# Altium project Alimentation.PrjPcb
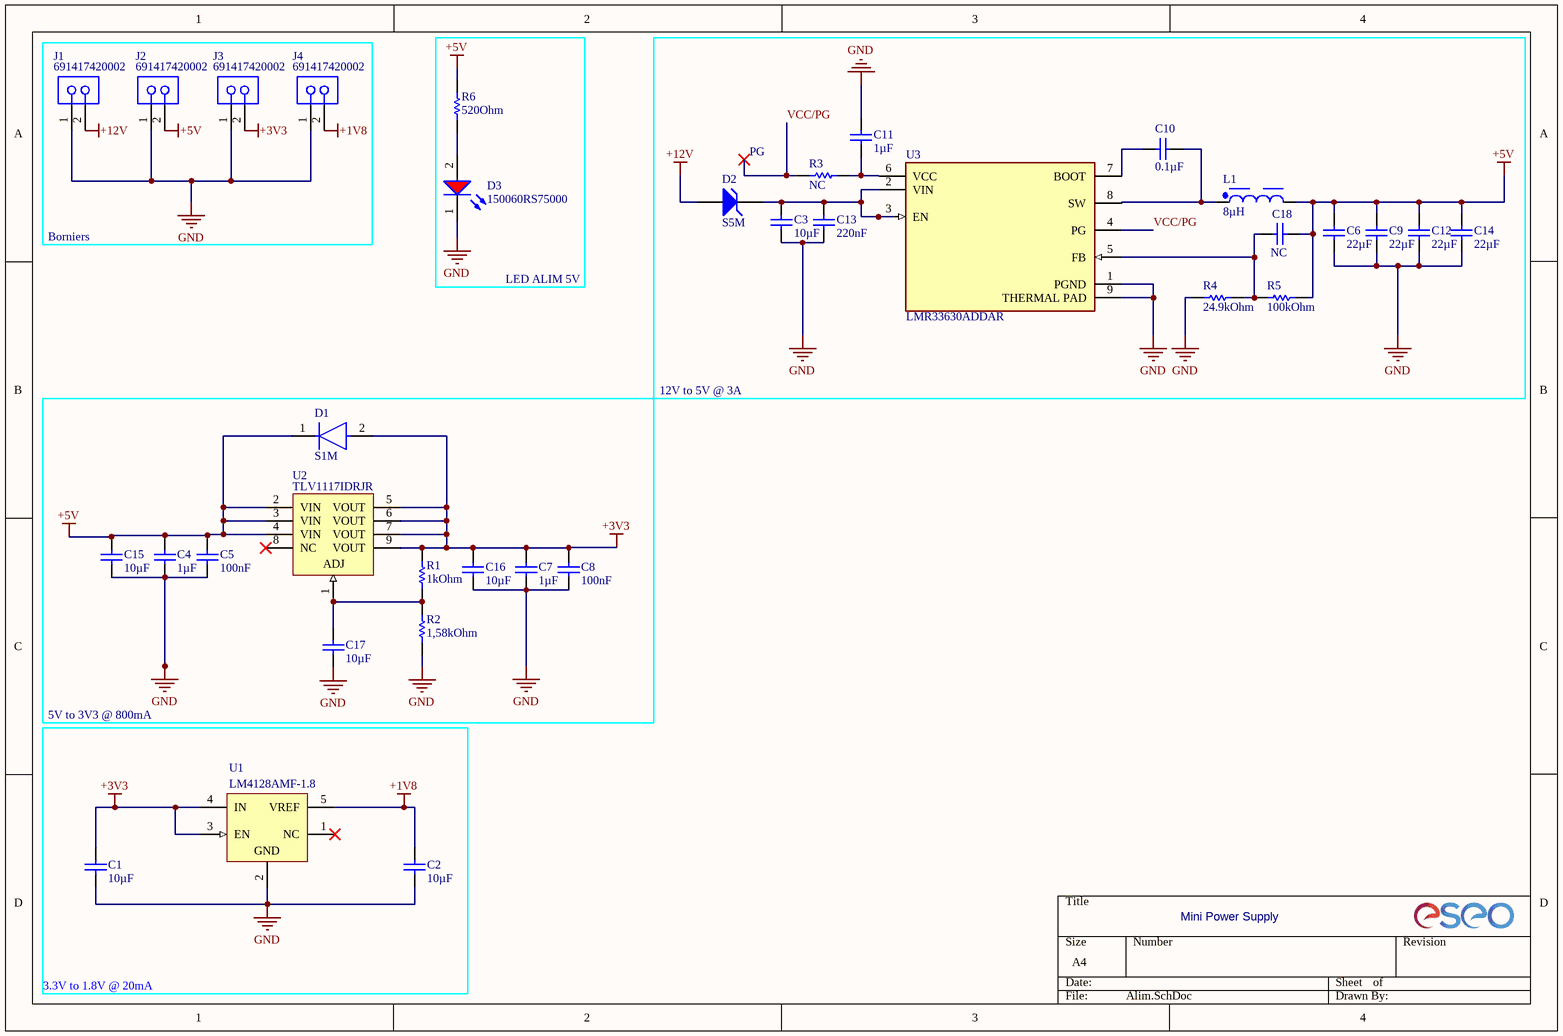
[diagram p0: Alim.SchDoc]
1 sheet, 35 parts. Net scope: global (net labels, ports and power ports of the same name join across sheets).
Board file: Alim.PcbDoc

## Sheet Alim.SchDoc
size A4; SheetNumber: 1; SheetTotal: 1

### Parts
C1  value 10µF  [CONDENSATEUR_CMS_1210]  (hidden comment: CMS_1210)
C2  value 10µF  [CONDENSATEUR_CMS_1210]  (hidden comment: CMS_1210)
C3  value 10µF  [CONDENSATEUR_CMS_1210]  (hidden comment: CMS_1210)
C4  value 1µF  [CONDENSATEUR_CMS_0603]  (hidden comment: CMS_0603)
C5  value 100nF  [CONDENSATEUR_CMS_0603]  (hidden comment: CMS_0603)
C6  value 22µF  [CONDENSATEUR_CMS_1210]  (hidden comment: CMS_1210)
C7  value 1µF  [CONDENSATEUR_CMS_0603]  (hidden comment: CMS_0603)
C8  value 100nF  [CONDENSATEUR_CMS_0603]  (hidden comment: CMS_0603)
C9  value 22µF  [CONDENSATEUR_CMS_1210]  (hidden comment: CMS_1210)
C10  value 0.1µF  [CONDENSATEUR_CMS_0603]  (hidden comment: CMS_0603)
C11  value 1µF  [CONDENSATEUR_CMS_0603]  (hidden comment: CMS_0603)
C12  value 22µF  [CONDENSATEUR_CMS_1210]  (hidden comment: CMS_1210)
C13  value 220nF  [CONDENSATEUR_CMS_0603]  (hidden comment: CMS_0603)
C14  value 22µF  [CONDENSATEUR_CMS_1210]  (hidden comment: CMS_1210)
C15  value 10µF  [CONDENSATEUR_CMS_1210]  (hidden comment: CMS_1210)
C16  value 10µF  [CONDENSATEUR_CMS_1210]  (hidden comment: CMS_1210)
C17  value 10µF  [CONDENSATEUR_CMS_1210]  (hidden comment: CMS_1210)
C18  value NC  [CONDENSATEUR_CMS_0603]  (hidden comment: CMS_0603)
D1  S1M  [DO-214AC]
D2  S5M  [DO-214AB]
D3  150060RS75000  [LED_0603]
J1  691417420002  [691417420002]
J2  691417420002  [691417420002]
J3  691417420002  [691417420002]
J4  691417420002  [691417420002]
L1  8µH  [WE-PDA_1260]
R1  value 1kOhm  [RESISTANCE_CMS_0603]  (hidden comment: RESISTANCE_CMS_0603)
R2  value 1,58kOhm  [RESISTANCE_CMS_0603]  (hidden comment: RESISTANCE_CMS_0603)
R3  value NC  [RESISTANCE_CMS_0603]  (hidden comment: RESISTANCE_CMS_0603)
R4  value 24.9kOhm  [RESISTANCE_CMS_0603]  (hidden comment: RESISTANCE_CMS_0603)
R5  value 100kOhm  [RESISTANCE_CMS_0603]  (hidden comment: RESISTANCE_CMS_0603)
R6  value 520Ohm  [RESISTANCE_CMS_0603]  (hidden comment: RESISTANCE_CMS_0603)
U1  LM4128AMF-1.8  [SOT23-5]
U2  TLV1117IDRJR  [WSON-8]
U3  LMR33630ADDAR  [HSOIC]

### Blocks framed on the sheet
Borniers: J1-J4
LED ALIM 5V: D3 R6
5V to 3V3 @ 800mA: C4 C5 C7 C8 C15-C17 D1 R1 R2 U2

### Nets
+1V8: C2.2 J4.2 U1.5(VREF)
+3V3: C1.2 C7.2 C8.2 C16.2 D1.2(A) J3.2 R1.2 U1.3(EN) U1.4(IN) U2.5(VOUT) U2.6(VOUT) U2.7(VOUT) U2.9(VOUT)
+5V: C4.2 C5.2 C6.2 C9.2 C12.2 C14.2 C15.2 C18.2 D1.1(C) J2.2 L1.2 R5.1 R6.2 U2.2(VIN) U2.3(VIN) U2.4(VIN)
+12V: D2.1(A) J1.2
GND: C1.1 C2.1 C3.1 C4.1 C5.1 C6.1 C7.1 C8.1 C9.1 C11.2 C12.1 C13.1 C14.1 C15.1 C16.1 C17.1 D3.1(K) J1.1 J2.1 J3.1 J4.1 R2.1 R4.2 U1.2(GND) U3.1(PGND) U3.9(THERMAL_PAD)
VCC/PG: R3.1 U3.4(PG)
NetC3_2: C3.2 C13.2 D2.2(K) U3.2(VIN) U3.3(EN)
NetC10_1: C10.1 U3.7(BOOT)
NetC10_2: C10.2 L1.1 U3.8(SW)
NetC11_1: C11.1 R3.2 U3.6(VCC)
NetC17_2: C17.2 R1.1 R2.2 U2.1(ADJ)
NetC18_1: C18.1 R4.1 R5.2 U3.5(FB)
NetD3_2: D3.2(A) R6.1

Not connected (* = marked no-connect by the designer): U1 1(NC)*; U2 8(NC)*

### Notes on the sheet
- PG
- 12V to 5V @ 3A
- Mini Power Supply
- 3.3V to 1.8V @ 20mA

### Library data of the parts
C1-C3 C6 C9 C12 C14-C17 = CONDENSATEUR_CMS_CER_1210: CONDENSATEUR CMS CERAMIQUE 1210; Type: CMS_1210
C4 C5 C7 C8 C10 C11 C13 C18 = CONDENSATEUR_CMS_CER_0603: CONDENSATEUR CMS CERAMIQUE 0603; Type: CMS_0603
D1 = S1M: DIODE GEN PURP 1KV 1A SMA; Manufacturer 1: ON Semiconductor / Fairchild; Element Configuration: Single; Peak Non-Repetitive Surge Current: 30A; Polarity: Standard; Max Surge Current: 40A; Forward Voltage: 1.1V; Capacitance: 12pF; Power Dissipation: 1.4W; Reverse Recovery Time: 1.8us; Peak Reverse Current: 1uA; Recovery Time: 1800ns; Contact Plating: Tin; Termination: SMD/SMT; Forward Current: 1A; Case/Package: SMA; Package Quantity: 1; Length: 4.75mm; Lead Free: Lead Free; Max Reverse Voltage (DC): 1kV; Reverse Voltage: 1kV; Height: 2.2mm; Current Rating: 1A; Number of Pins: 2; Max Operating Temperature: 150°C; Mount: Surface Mount; Max Forward Surge Current (Ifsm): 30A; Width: 5.28mm; Max Repetitive Reverse Voltage (Vrrm): 1kV; Current: 1A; Voltage: 1kV; Voltage Rating (DC): 1kV; REACH SVHC: No SVHC; Min Operating Temperature: -55°C; Packaging: Tape and Reel; Output Current: 1A; Radiation Hardening: No; Average Rectified Current: 1A; Manufacturer Part Number 1: S1M
D2 = S5M: Transient Voltage Suppression Diode, 30 V, -65 to 150 degC, 2-Pin DO-214AB (SMCJ), RoHS, Tape and Reel; Manufacturer: Littelfuse-Inc.; Manufacturer 1: Littelfuse; Manufacturer Part Number 1: SMCJ30A; Current - Peak Pulse (10/1000µs): 31A; Voltage - Reverse Standoff (Typ): 30V; Type: Zener; Voltage - Breakdown (Min): 33.3V; Voltage - Clamping (Max) @ Ipp: 48.4V; Power - Peak Pulse: 1500W(1.5kW); Power Line Protection: No; Unidirectional Channels: 1; Capacitance @ Frequency: -; Package / Case: DO-214AB,SMC; Supplier Device Package: DO-214AB(SMCJ); Mounting Type: SurfaceMount; Series: SMCJ; Package Description: 2-Pin Surface Mount Device, Body 6.855 x 5.905 mm; Packaging: Digi-Reel®; Mounting Technology: SurfaceMount; Applications: GeneralPurpose; Operating Temperature: -55°C~150°C(TJ); Datasheet Version: 11/2015; Family: TVS-Diodes; Manufacturer URL: http://www.littelfuse.com/; Category: CircuitProtection; Bidirectional Channels: -; Datasheet URL: http://www.littelfuse.com/products/tvs-diodes/surface-mount/~/media/electronics/datasheets/tvs_diodes/littelfuse_tvs_diode_smcj_datasheet.pdf.pdf; Package Reference: DO-214AB
D3 = LED 150060RS75000: LED 0603 Générique; NexarPartId: 29717776; Manufacturer 1: Wurth Electronics; Color: Red; Power Dissipation: 72mW; Max Reverse Voltage (DC): 5V; Peak Wavelength: 630nm; Viewing Angle: 140°; Forward Voltage: 2V; Luminous Intensity: 250mcd; Forward Current: 100mA; Dominant Wavelength: 625nm; Lens Style: Clear, Rectangular; Max Junction Temperature (Tj): 95°C; Test Current: 20mA; Mount: Surface Mount; Packaging: Tape and Reel; Case Code (Metric): 1608; Max Operating Temperature: 85°C; Case Code (Imperial): 0603; REACH SVHC: Unknown; Width: 800µm; Length: 1.6mm; Reverse Voltage: 5V; Height: 700µm; Case/Package: 0603; RoHS: Compliant; Wavelength: 625nm; Min Operating Temperature: -40°C; Manufacturer Part Number 1: 150060RS75000
J1-J4 = Bornier 691417420002: Bornier poussoir 7,62mm; NexarPartId: 105951396; Manufacturer 1: Wurth Electronics; Manufacturer Part Number 1: 691417420002
L1 = Self 784771100: 784771100 Inductor, Aec-Q200, 10Uh, Shld, 5A Rohs Compliant: Yes; NexarPartId: 56466860; Manufacturer 1: Wurth Electronics; DC Resistance (DCR): 22mΩ; Core Material: Ferrite; Saturation Current: 5.25A; Self Resonant Frequency: 22.3MHz; Inductance: 10µH; Tolerance: 20%; Test Frequency: 100kHz; Shielding: Shielded; Height - Seated (Max): 6.2992mm; Ambient Temperature Range High: 85°C; Height: 6mm; Mount: Surface Mount; RoHS: Compliant; Length: 12mm; Composition: Wirewound; Min Operating Temperature: -40°C; Current Rating: 5A; Max Operating Temperature: 125°C; Width: 12mm; Ambient Temperature Range Low: -40°C; Case/Package: Nonstandard; Number of Pins: 2; Ratings: AEC-Q200; Manufacturer Part Number 1: 784771100
R1-R6 = RESISTANCE_CMS_0603: RESISTANCE CMS 0603; Type: CMS_0603
U1 = LM4128AMF-1.8: Precision Micropower Series Voltage Reference, 5-pin SOT-23; Manufacturer: National Semiconductor; Manufacturer 1: TI National Semiconductor; PowerWise: Y; PackageTopMarking: R5AA*XTT; CompType: Voltage Reference IC; ComponentLink2URL: http://www.national.com/pf/LM/LM4128.html; RevisionNote: Component URLs added; PackageReference: MF05A; ComponentLink2Description: LM4128 Web Page; PackageVersion: revD, Aug-2008; DatasheetVersion: Nov-2006; ComponentLink1URL: http://www.national.com/ds/LM/LM4128.pdf; PinCount: 5; ComponentLink1Description: LM4128 Datasheet; RoHS: N; ComponentLink3Description: MF05A Package Page; ComponentLink3URL: http://www.national.com/packaging/folders/mf05a.html; PackageDescription: Molded SOT-23, .115 x .063 x .040 in Body, 5 Lead, .0375 in Pitch; Manufacturer Part Number 1: LM4128AMF-1.8
U2 = TLV1117IDRJR: LDO with 2.7 to 15 V Input and 1.25 to 13.7 V Output, -40 to 125 degC, 8-Pin SON (DRJ), Green (RoHS & no Sb/Br); Manufacturer: Texas Instruments; Vout(Max)(V): 13.7; Vout(Min)(V): 1.25; Vin(Min)(V): 2.7; Iq(Typ)(mA): 5; Iout(Max)(A): 0.8; Vin(Max)(V): 15; ComponentLink3URL: Samples URL:http://www.ti.com/product/tlv1117#samples; PackageVersion: revC, Dec-2010; ComponentLink2URL: http://www.ti.com/litv/pdf/mpds153b; PackageDescription: 8-Pin Plastic Small Outline No-Lead, 4 x 4 x 0.8 mm Body, 0.8 mm Pitch, Exposed Pad; DatasheetVersion: SLVS561J; PartNumber: TLV1117IDRJR; ComponentLink3Description: URL Link1; Eco-Plan: Green (RoHS & no Sb/Br); ComponentLink1URL: http://www.ti.com/general/docs/lit/getliterature.tsp?genericPartNumber=TLV1117&fileType=pdf; Mounting Technology: Surface Mount; ComponentLink2Description: Package Specification; PackageReference: DRJ0008A; ComponentLink1Description: Datasheet; Manufacturer 1: Texas Instruments; Manufacturer Part Number 1: TLV1117IDRJR
U3 = LMR33630ADDAR: IC REG BUCK ADJUSTABLE 3A 8SOPWR; Manufacturer 1: Texas Instruments; Switching Frequency: 400kHz; Number of Outputs: 1; Output Configuration: Positive; Synchronous Rectifier: Yes; Min Output Voltage: 1V; Max Output Voltage: 24V; Max Input Voltage: 36V; Min Input Voltage: 3.8V; Output Current: 3A; Min Operating Temperature: -40°C; Max Operating Temperature: 125°C; Number of Pins: 8; RoHS Compliant: Yes; Mount: Surface Mount; Output Type: Adjustable; Packaging: Cut Tape; Manufacturer Part Number 1: LMR33630ADDAR